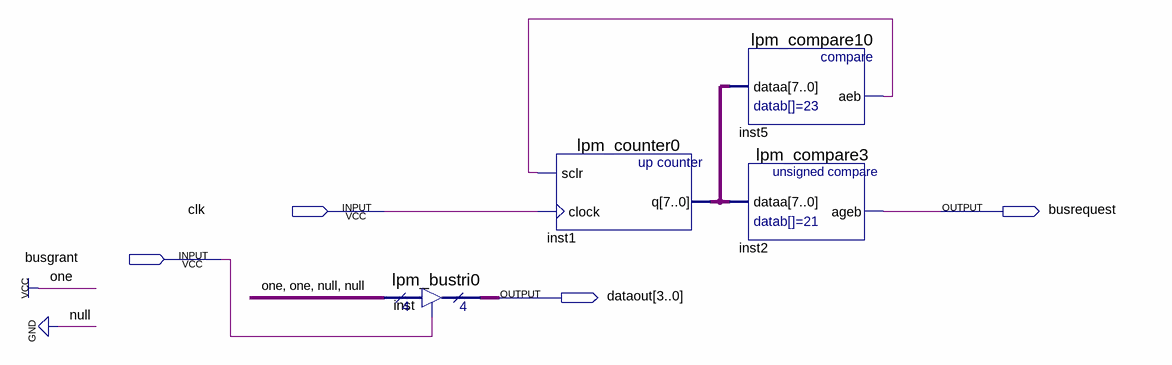
[diagram p0: schematic sheet]
// Quartus schematic lead_4.bdf as structural Verilog: 4 symbols, 4 pins
module lead_4 (
  input  clk,
  input  busgrant,
  output busrequest,
  output [3:0] dataout
);

  wire inst5_aeb;
  wire [7:0] inst1_q;

  lpm_bustri0 inst (.enabledt(busgrant), .data(4'b1100), .tridata(dataout));
  lpm_counter0 inst1 (.sclr(inst5_aeb), .clock(clk), .q(inst1_q));
  lpm_compare10 inst5 (.dataa(inst1_q), .aeb(inst5_aeb));
  lpm_compare3 inst2 (.dataa(inst1_q), .ageb(busrequest));
endmodule
